# EAGLE design pic_can_router (EAGLE 6.5.0)
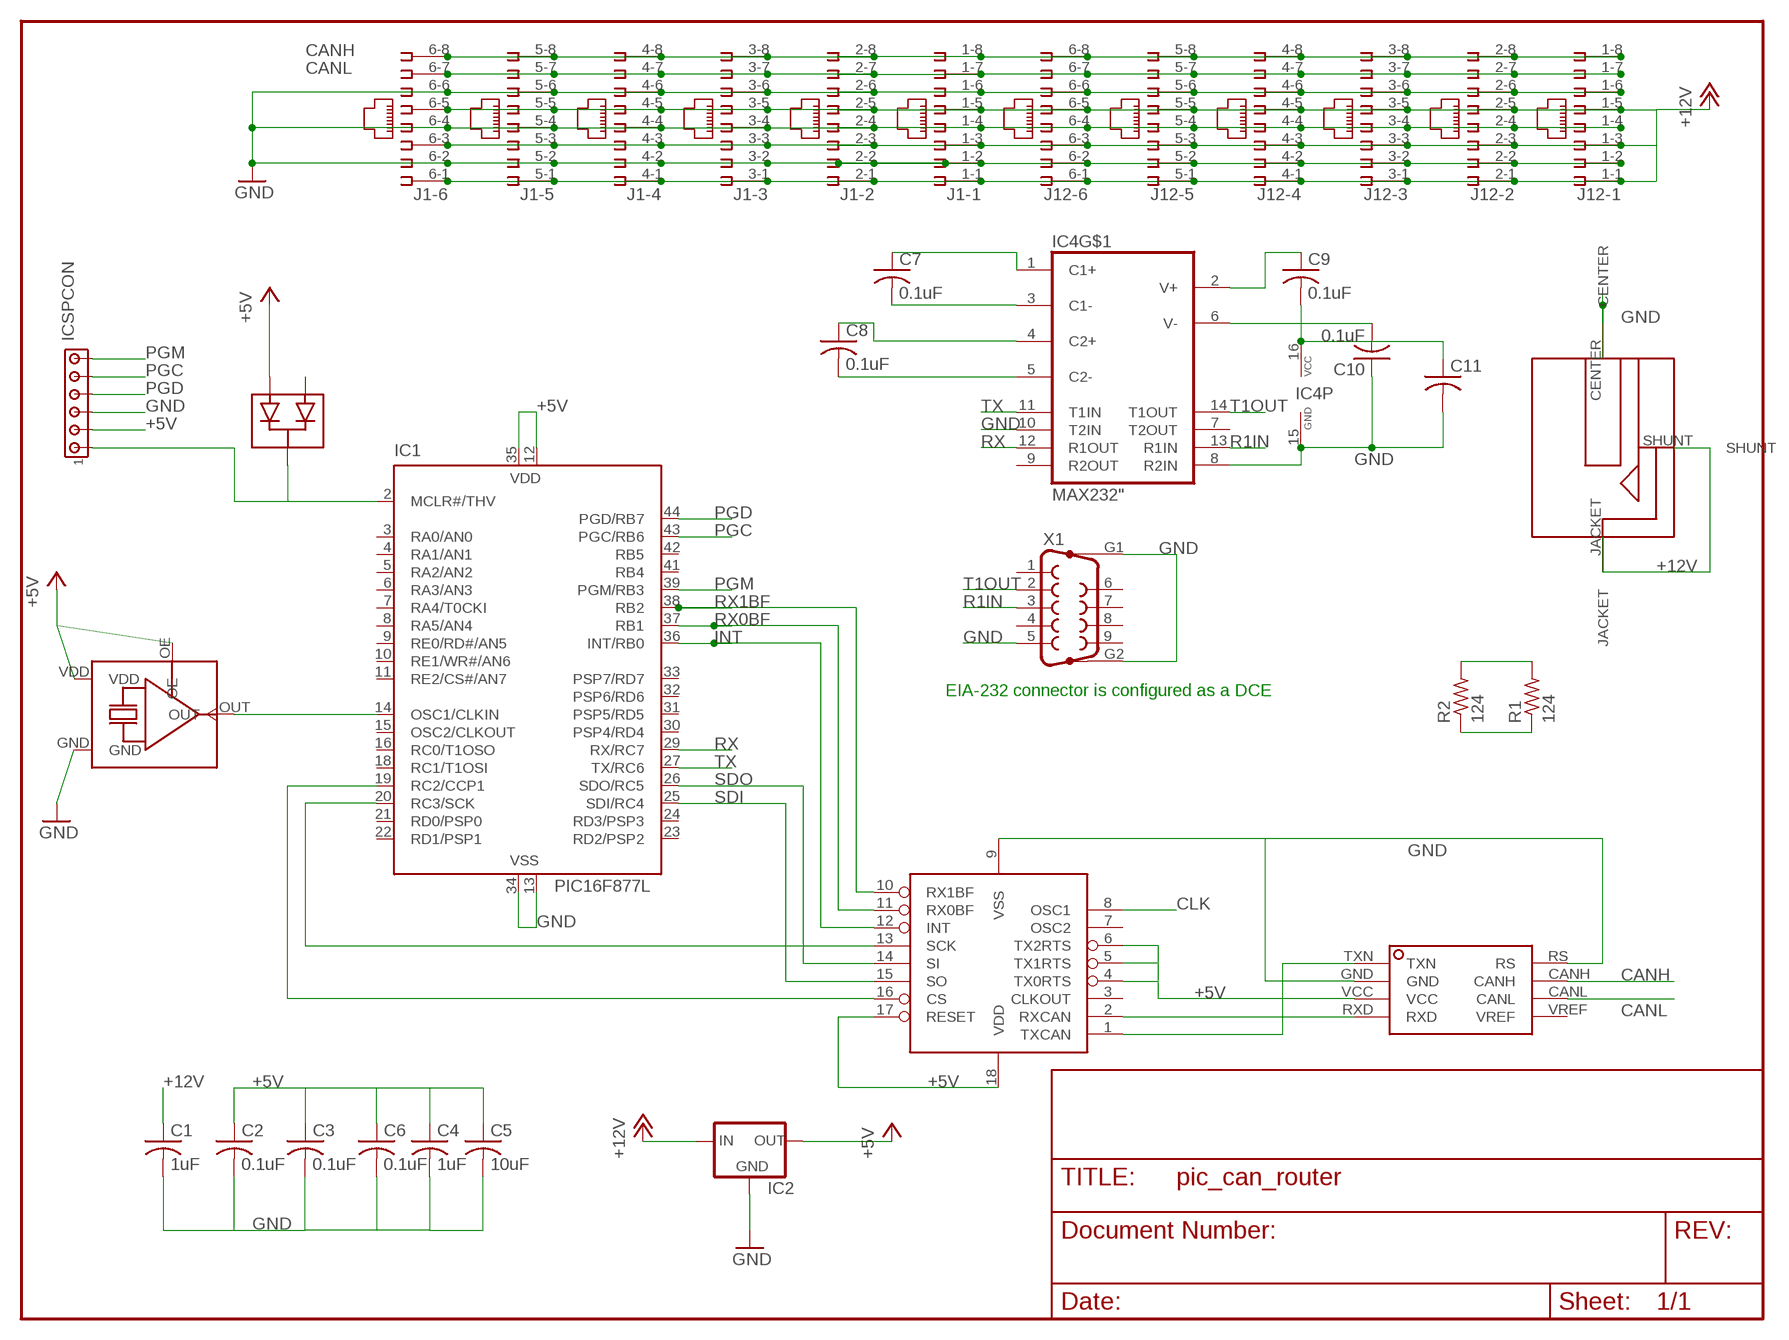
[diagram p0: schematic, sheet 1]

## Parts
C1  1uF  C-USC1206  [C1206]
C2  0.1uF  C-USC0805  [C0805]
C3  0.1uF  C-USC0805  [C0805]
C4  1uF  C-USC1206  [C1206]
C5  10uF  C-USC1210  [C1210]
C6  0.1uF  C-USC0805  [C0805]
C7  0.1uF  C-USC0805  [C0805]
C8  0.1uF  C-USC0805  [C0805]
C9  0.1uF  C-USC0805  [C0805]
C10  0.1uF  C-USC0805  [C0805]
C11  C-USC0805  [C0805]
IC1  PIC16F877L  [PLCC-44]
IC2  78XXL  [78XXL]
IC3  UC5350D  [SOIC8]
IC4  MAX232"  [SO16]
ICSPCON  MTA06-100  [10X06MTA]
J1  557564-1  [557564-1]
J12  557564-1  [557564-1]
MCP1  MCP2510-I/SO  [SO-18W@1]
R1  124  R-US_R0805  [R0805]
R2  124  R-US_R0805  [R0805]
U$1  SG-615P  [SG-615]
U$2  BAV70_  [SOT-23]
U$3  RAPC712"  [RAPC712]
X1  F09HP  [F09HP]

## Nets
+5V: C2.1 C3.1 C4.1 C5.1 C6.1 C9.2 C11.1 IC1.12(VDD) IC1.35(VDD) IC2.OUT IC3.VCC IC4.16(P:VCC) ICSPCON.5 MCP1.4(TX0RTS) MCP1.5(TX1RTS) MCP1.6(TX2RTS) MCP1.17(RESET) MCP1.18(VDD) U$1.OE U$1.VDD U$2.2(A2)
+12V: C1.1 IC2.IN J1.1-1 J1.1-3 J1.1-5 J1.2-1 J1.2-3 J1.2-5 J1.3-1 J1.3-3 J1.3-5 J1.4-1 J1.4-3 J1.4-5 J1.5-1 J1.5-3 J1.5-5 J1.6-1 J1.6-3 J1.6-5 J12.1-1 J12.1-3 J12.1-5 J12.2-1 J12.2-3 J12.2-5 J12.3-1 J12.3-3 J12.3-5 J12.4-1 J12.4-3 J12.4-5 J12.5-1 J12.5-3 J12.5-5 J12.6-1 J12.6-3 J12.6-5 U$3.JACKET U$3.SHUNT
CANH: IC3.CANH J1.1-8 J1.2-8 J1.3-8 J1.4-8 J1.5-8 J1.6-8 J12.1-8 J12.2-8 J12.3-8 J12.4-8 J12.5-8 J12.6-8 R1.2 R2.2
CANL: IC3.CANL J1.1-7 J1.2-7 J1.3-7 J1.4-7 J1.5-7 J1.6-7 J12.1-7 J12.2-7 J12.3-7 J12.4-7 J12.5-7 J12.6-7 R1.1 R2.1
CLK: IC1.14(OSC1/CLKIN) MCP1.8(OSC1) U$1.OUT
CS: IC1.19(RC2/CCP1) MCP1.16(CS)
GND: C1.2 C2.2 C3.2 C4.2 C5.2 C6.2 C10.1 C11.2 IC1.13(VSS) IC1.34(VSS) IC2.GND IC3.GND IC3.RS IC4.8(R2IN) IC4.10(T2IN) IC4.15(P:GND) ICSPCON.4 J1.1-2 J1.1-4 J1.1-6 J1.2-2 J1.2-4 J1.2-6 J1.3-2 J1.3-4 J1.3-6 J1.4-2 J1.4-4 J1.4-6 J1.5-2 J1.5-4 J1.5-6 J1.6-2 J1.6-4 J1.6-6 J12.1-2 J12.1-4 J12.1-6 J12.2-2 J12.2-4 J12.2-6 J12.3-2 J12.3-4 J12.3-6 J12.4-2 J12.4-4 J12.4-6 J12.5-2 J12.5-4 J12.5-6 J12.6-2 J12.6-4 J12.6-6 MCP1.9(VSS) U$1.GND U$3.CENTER X1.5 X1.G1 X1.G2
INT: IC1.36(INT/RB0) MCP1.12(INT)
N$1: C7.1 IC4.1(C1+)
N$2: C7.2 IC4.3(C1-)
N$3: C8.2 IC4.5(C2-)
N$4: C8.1 IC4.4(C2+)
N$6: IC1.2(MCLR#/THV) ICSPCON.6 U$2.3(C)
N$7: C9.1 IC4.2(V+)
N$8: C10.2 IC4.6(V-)
PGC: IC1.43(PGC/RB6) ICSPCON.2
PGD: IC1.44(PGD/RB7) ICSPCON.3
PGM: IC1.39(PGM/RB3) ICSPCON.1
R1IN: IC4.13(R1IN) X1.3
RX: IC1.29(RX/RC7) IC4.12(R1OUT)
RX0BF: IC1.37(RB1) MCP1.11(RX0BF)
RX1BF: IC1.38(RB2) MCP1.10(RX1BF)
RXCAN: IC3.RXD MCP1.2(RXCAN)
SCK: IC1.20(RC3/SCK) MCP1.13(SCK)
SDI: IC1.25(SDI/RC4) MCP1.15(SO)
SDO: IC1.26(SDO/RC5) MCP1.14(SI)
T1OUT: IC4.14(T1OUT) X1.2
TX: IC1.27(TX/RC6) IC4.11(T1IN)
TXCAN: IC3.TXN MCP1.1(TXCAN)
Unconnected: IC1.3(RA0/AN0) IC1.4(RA1/AN1) IC1.5(RA2/AN2) IC1.6(RA3/AN3) IC1.7(RA4/T0CKI) IC1.8(RA5/AN4) IC1.9(RE0/RD#/AN5) IC1.10(RE1/WR#/AN6) IC1.11(RE2/CS#/AN7) IC1.15(OSC2/CLKOUT) IC1.16(RC0/T1OSO) IC1.18(RC1/T1OSI) IC1.21(RD0/PSP0) IC1.22(RD1/PSP1) IC1.23(RD2/PSP2) IC1.24(RD3/PSP3) IC1.30(PSP4/RD4) IC1.31(PSP5/RD5) IC1.32(PSP6/RD6) IC1.33(PSP7/RD7) IC1.41(RB4) IC1.42(RB5) IC3.VREF IC4.7(T2OUT) IC4.9(R2OUT) MCP1.3(CLKOUT) MCP1.7(OSC2) U$2.1(A1) X1.1 X1.4 X1.6 X1.7 X1.8 X1.9

## Notes on the sheet
- EIA-232 connector is configured as a DCE

## Library data of the parts
C1-C11 = rcl:C-US: CAPACITOR, American symbol
IC1 = microchip:PIC16F87*: MICROCONTROLLER
IC2 = v-reg:78XXL: VOLTAGE REGULATOR
IC3 = house:UC5350: CAN Tranceiver
IC4 = maxim:MAX232: RS232 TRANSEIVER
ICSPCON = con-amp:MTA06-100: AMP CONNECTOR
J1 J12 = con-amp:557564-1: AMP CONNECTOR
MCP1 = microchip:MCP2510
R1 R2 = rcl:R-US_: RESISTOR, American symbol
U$1 = house:SG-615: Epson Electronics CMOS/TTL SMD Oscillator
U$2 = house:BAV70: Fairchild Semiconductor Small Signal, Dual, Common Cathode, SOT-23 Diode
U$3 = house:RAPC712
X1 = con-subd:F09HP: SUB-D

## Board
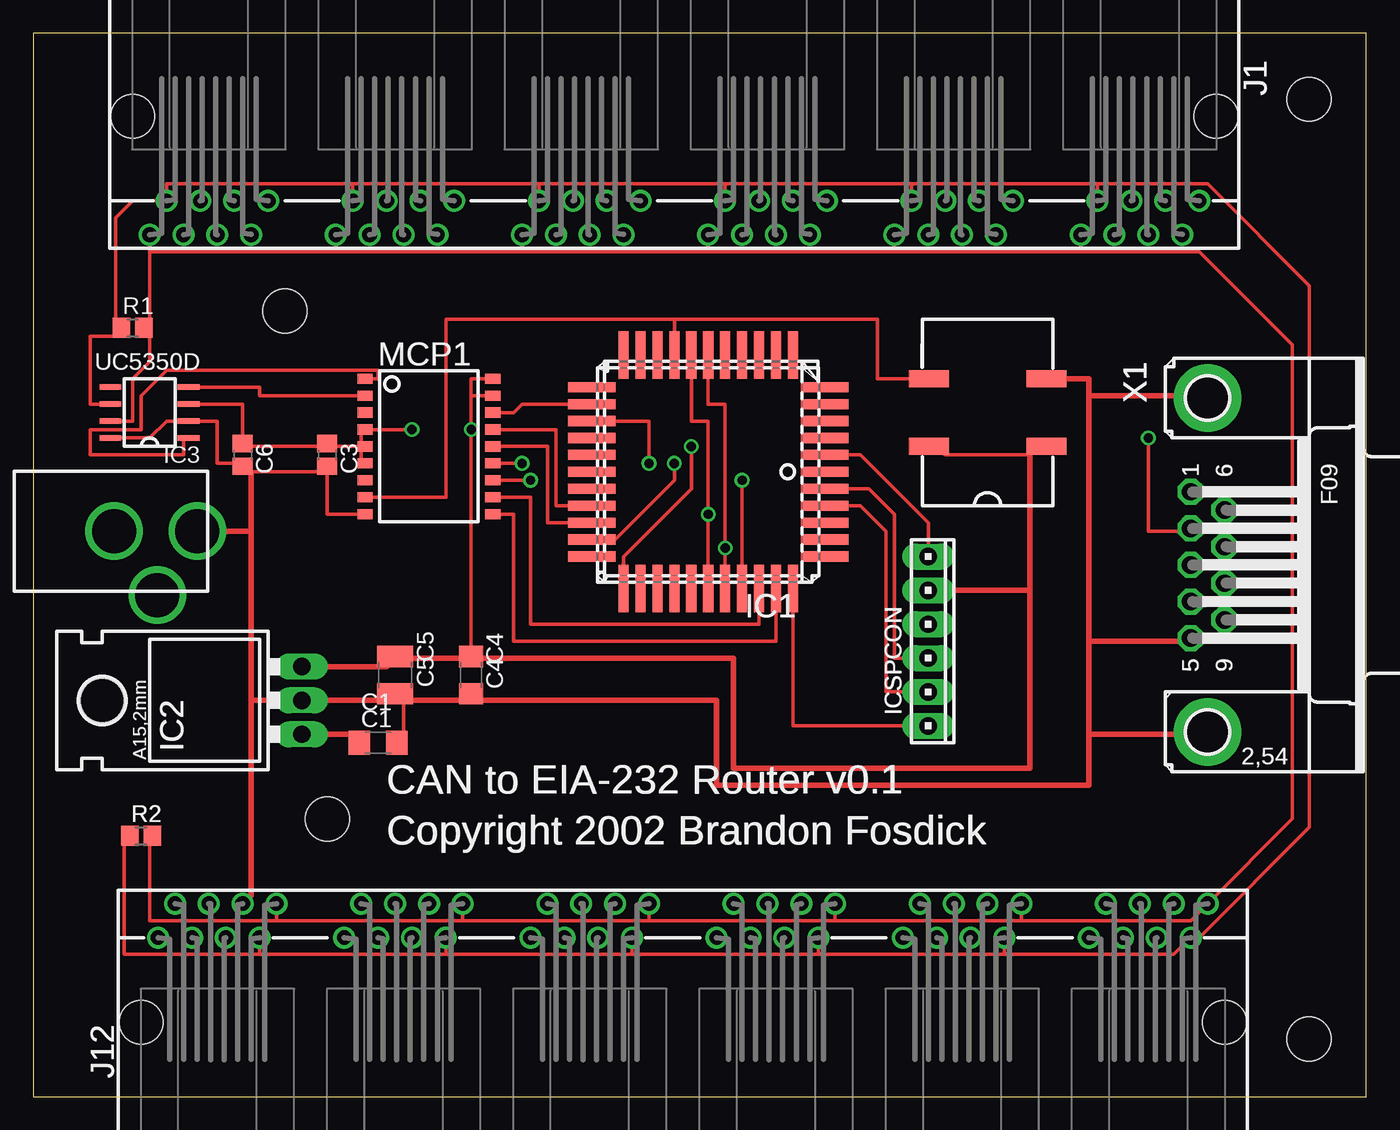
[diagram p1: board, top side]
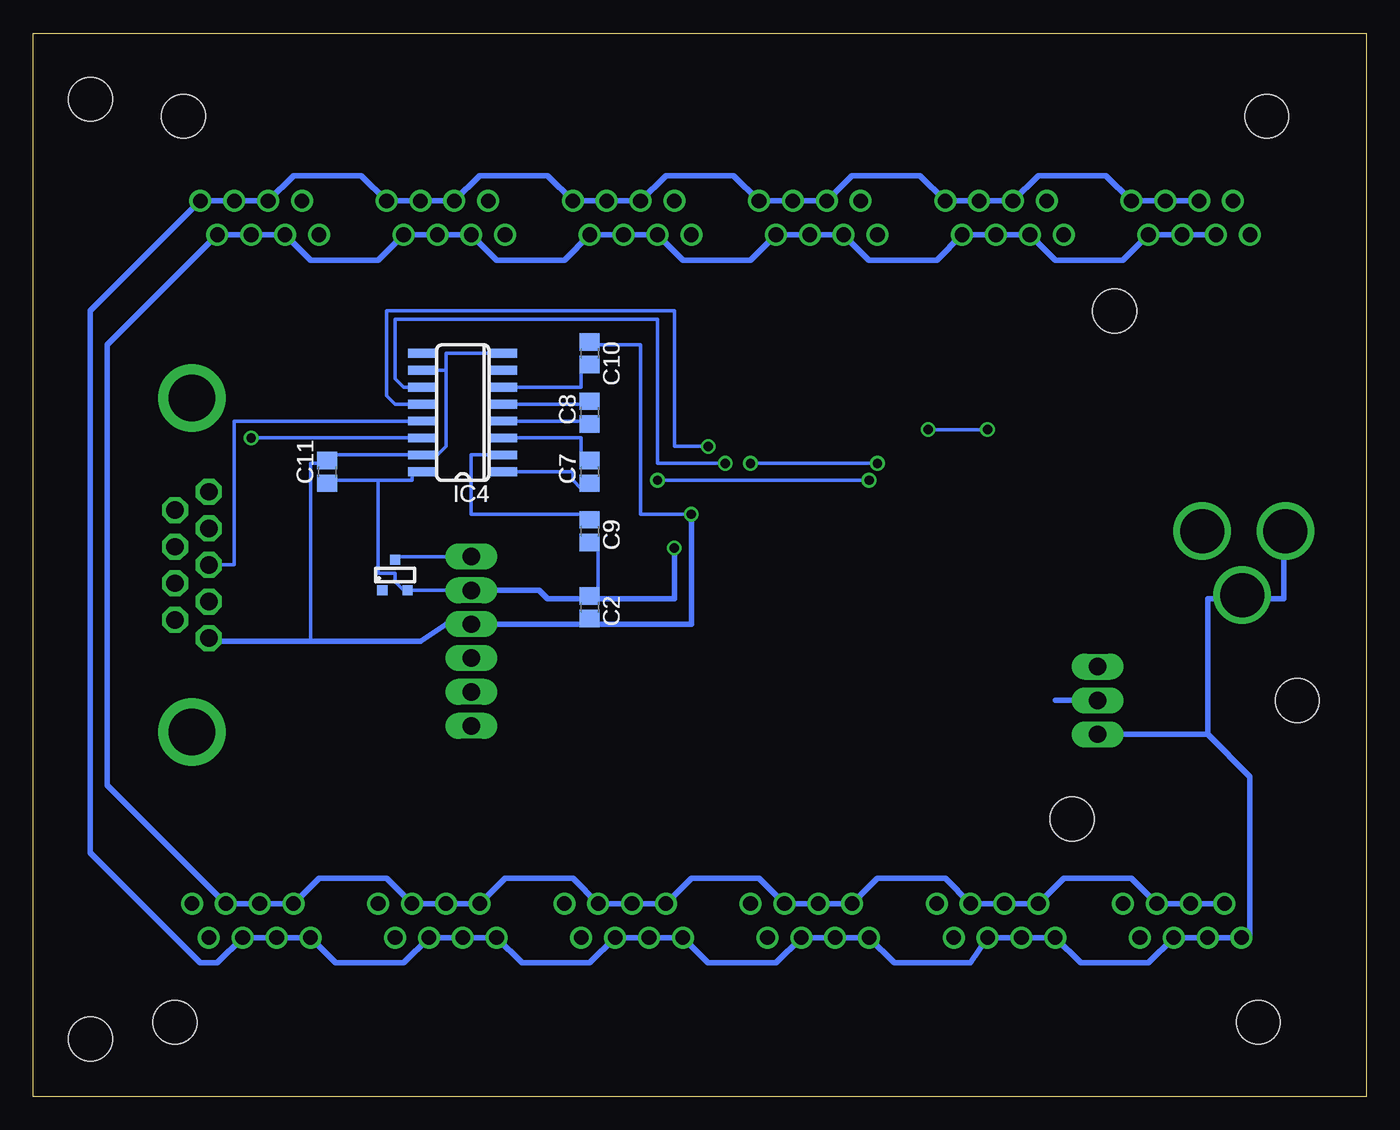
[diagram p2: board, bottom side, seen from below]

Size 100 x 79.75 mm. Coordinates in mm from the lower left corner, seen from the top.
Outline: 0,0 100,0 100,79.75 0,79.75 0,0
Copper layers (1*16): Top 0.035mm / dielectric 1.5mm / Bottom 0.035mm
Design rules "10mils": minimum track width 10mil, minimum drill 24mil, track to track 10mil, track to pad 10mil, pad to pad 10mil, via to via 10mil, smd to smd 10mil, copper to edge 40mil, drill to drill 10mil, minimum pad ring 10mil, minimum via ring 8mil, stop-mask expansion 0mil, vias tented up to drill 0mil, thermal gap 10mil
Holes 3.3 mm at 22.06,20.82 95.72,4.31 95.72,74.8 18.88,58.92

### Footprints (pad centres in the part's own frame; a part is rotated, then mirrored left to right if it is on the bottom)
C1206 = smd 1.6 x 1.8: 1 -1.4,0; 2 1.4,0
C0805 = smd 1.3 x 1.5: 1 -0.85,0; 2 0.85,0
C1210 = smd 1.6 x 2.7: 1 -1.4,0; 2 1.4,0
PLCC-44 = smd 3.556 x 0.762: 1 -8.749,0; 2 -8.749,-1.27; 3 -8.749,-2.54; 4 -8.749,-3.81; 5 -8.749,-5.08; 6 -8.749,-6.35; 18 8.749,-6.35; 19 8.749,-5.08; 20 8.749,-3.81; 21 8.749,-2.54; 22 8.749,-1.27; 23 8.749,0; 24 8.749,1.27; 25 8.749,2.54; 26 8.749,3.81; 27 8.749,5.08; 28 8.749,6.35; 40 -8.749,6.35; 41 -8.749,5.08; 42 -8.749,3.81; 43 -8.749,2.54; 44 -8.749,1.27 | smd 0.762 x 3.556: 7 -6.35,-8.749; 8 -5.08,-8.749; 9 -3.81,-8.749; 10 -2.54,-8.749; 11 -1.27,-8.749; 12 0,-8.749; 13 1.27,-8.749; 14 2.54,-8.749; 15 3.81,-8.749; 16 5.08,-8.749; 17 6.35,-8.749; 29 6.35,8.749; 30 5.08,8.749; 31 3.81,8.749; 32 2.54,8.749; 33 1.27,8.749; 34 0,8.749; 35 -1.27,8.749; 36 -2.54,8.749; 37 -3.81,8.749; 38 -5.08,8.749; 39 -6.35,8.749
78XXL = drill 1.3 long: GND 0,-3.81; IN -2.54,-3.81; OUT 2.54,-3.81 | hole 3.302: 0,11.176
SOIC8 = smd 1.626 x 0.406: CANH 2.934,1.27; CANL 2.934,0; GND -2.934,1.27; RS 2.934,2.54; RXD -2.934,-1.27; TXN -2.934,2.54; VCC -2.934,0; VREF 2.934,-1.27
SO16 = smd 0.66 x 2.032: 1 -4.445,-3.073; 2 -3.175,-3.073; 3 -1.905,-3.073; 4 -0.635,-3.073; 5 0.635,-3.073; 6 1.905,-3.073; 7 3.175,-3.073; 8 4.445,-3.073; 9 4.445,3.073; 10 3.175,3.073; 11 1.905,3.073; 12 0.635,3.073; 13 -0.635,3.073; 14 -1.905,3.073; 15 -3.175,3.073; 16 -4.445,3.073
10X06MTA = drill 1.3 long: 1 6.35,0; 2 3.81,0; 3 1.27,0; 4 -1.27,0; 5 -3.81,0; 6 -6.35,0
557564-1 = drill 1.1: 1-1 -39.37,6.35; 1-2 -38.1,8.89; 1-3 -36.83,6.35; 1-4 -35.56,8.89; 1-5 -34.29,6.35; 1-6 -33.02,8.89; 1-7 -31.75,6.35; 1-8 -30.48,8.89; 2-1 -25.4,6.35; 2-2 -24.13,8.89; 2-3 -22.86,6.35; 2-4 -21.59,8.89; 2-5 -20.32,6.35; 2-6 -19.05,8.89; 2-7 -17.78,6.35; 2-8 -16.51,8.89; 3-1 -11.43,6.35; 3-2 -10.16,8.89; 3-3 -8.89,6.35; 3-4 -7.62,8.89; 3-5 -6.35,6.35; 3-6 -5.08,8.89; 3-7 -3.81,6.35; 3-8 -2.54,8.89; 4-1 2.54,6.35; 4-2 3.81,8.89; 4-3 5.08,6.35; 4-4 6.35,8.89; 4-5 7.62,6.35; 4-6 8.89,8.89; 4-7 10.16,6.35; 4-8 11.43,8.89; 5-1 16.51,6.35; 5-2 17.78,8.89; 5-3 19.05,6.35; 5-4 20.32,8.89; 5-5 21.59,6.35; 5-6 22.86,8.89; 5-7 24.13,6.35; 5-8 25.4,8.89; 6-1 30.48,6.35; 6-2 31.75,8.89; 6-3 33.02,6.35; 6-4 34.29,8.89; 6-5 35.56,6.35; 6-6 36.83,8.89; 6-7 38.1,6.35; 6-8 39.37,8.89 | hole 3.3: -40.64,0; 40.64,0
SO-18W@1 = smd 0.762 x 1.143: 1 -5.08,-4.788; 2 -3.81,-4.788; 3 -2.54,-4.788; 4 -1.27,-4.788; 5 0,-4.788; 6 1.27,-4.788; 7 2.54,-4.788; 8 3.81,-4.788; 9 5.08,-4.788; 10 5.08,4.788; 11 3.81,4.788; 12 2.54,4.788; 13 1.27,4.788; 14 0,4.788; 15 -1.27,4.788; 16 -2.54,4.788; 17 -3.81,4.788; 18 -5.08,4.788
R0805 = smd 1.3 x 1.5: 1 -0.85,0; 2 0.85,0
SG-615 = smd 1.27 x 3: GND 2.54,-4.4; OE -2.54,-4.4; OUT 2.54,4.41; VDD -2.54,4.4
SOT-23 = smd 0.76 x 0.76: 1 -0.95,0; 2 0.95,0; 3 0,2.29
RAPC712 = drill 3.3: CENTER 0,13.74; JACKET 0,7.49; SHUNT 4.8,10.74
F09HP = drill 1.3 octagon: 1 -5.486,-1.27; 2 -2.743,-1.27; 3 0,-1.27; 4 2.743,-1.27; 5 5.486,-1.27; 6 -4.115,1.27; 7 -1.372,1.27; 8 1.372,1.27; 9 4.115,1.27 | drill 3.5 pad 5.08: G1 -12.522,0; G2 12.522,0

### Placement (x,y rotation side)
C1  25.87,26.54 0 top
C2  58.25,36.7 270 bottom
C3  22.06,48.13 270 top
C4  32.85,31.62 270 top
C5  27.14,31.62 270 top
C6  15.71,48.13 270 top
C7  58.25,46.86 90 bottom
C8  58.25,51.3 90 bottom
C9  58.25,42.41 270 bottom
C10  58.25,55.75 270 bottom
C11  77.94,46.86 90 bottom
IC1  50.63,46.86 180 top
IC2  16.34,29.71 90 top
IC3  8.73,51.94 180 top
IC4  67.78,51.3 90 bottom
ICSPCON  67.14,34.16 270 top
J1  48.09,73.53 180 top
J12  48.73,5.58 0 top
MCP1  29.68,48.76 270 top
R1  7.46,57.65 0 top
R2  8.09,19.55 0 top
U$1  71.59,51.3 90 top
U$2  72.86,37.97 0 bottom
U$3  -1.44,42.41 270 top
X1  88.1,39.87 270 top

### Tracks (layer width: path | path; a pad name or v marks a point on that pad's centre or on a via)
+5V  (via drill 0.7)
  Top 0.254: 32.85,52.57 32.85,53.84 MCP1.18 33.49,53.84 | 32.85,52.57 v32.85,50.03 C4.1 | 32.85,52.57 MCP1.17 | v28.41,50.03 MCP1.4 24.6,50.03 24.6,48.76 | IC3.VCC 15.71,51.94 15.71,48.76 15.08,48.76 C6.1 16.34,48.76 21.42,48.76 C3.1 22.7,48.76 24.6,48.76 | 24.6,48.76 24.6,47.49 MCP1.6 | 24.6,48.76 MCP1.5 | U$1.VDD 68.41,48.13 74.77,48.13 U$1.OE | 28.41,32.89 C5.1 26.5,32.25 | 32.22,32.89 C4.1 | 50.63,53.84 50.63,51.94 51.91,51.94 v51.91,41.14 IC1.35 | 50.63,53.84 50.63,54.48 | C4.1 32.85,32.89 | 50.63,53.84 IC1.12
  Top 0.406: 28.41,32.89 32.22,32.89 | IC2.OUT 26.5,32.25 | 74.77,37.97 74.77,48.13 | 74.77,37.97 ICSPCON.5 | 32.85,32.89 52.54,32.89 52.54,24.63 74.77,24.63 74.77,37.97
  Bottom 0.254: v32.85,50.03 v28.41,50.03 | ICSPCON.5 U$2.2 72.22,37.97 72.86,38.6 72.86,39.24 74.13,39.24 74.13,46.22 | 70.32,46.86 IC4.16 71.59,46.86 71.59,46.22 74.13,46.22 | 74.13,46.22 77.3,46.22 C11.1 | 57.62,37.33 C2.1 57.62,37.97 57.62,41.14 C9.2
  Bottom 0.406: v51.91,41.14 51.91,37.33 57.62,37.33 61.43,37.33 62.06,37.97 ICSPCON.5
+12V
  Top 0.254: 24.6,27.17 C1.1
  Top 0.406: IC2.IN 24.6,27.17
  Bottom 0.254: 9.36,37.33 U$3.SHUNT | 6.18,41.14 U$3.JACKET
  Bottom 0.406: J1.6-5 J1.6-3 J1.6-1 19.52,69.08 24.6,69.08 J1.5-5 J1.5-3 J1.5-1 33.49,69.08 38.57,69.08 J1.4-5 J1.4-3 J1.4-1 47.46,69.08 52.54,69.08 J1.3-5 J1.3-3 J1.3-1 61.43,69.08 66.51,69.08 J1.2-5 J1.2-3 J1.2-1 75.4,69.08 80.48,69.08 J1.1-5 J1.1-3 J1.1-1 95.72,58.92 95.72,18.28 87.47,10.03 86.19,10.03 J12.6-5 J12.6-3 J12.6-1 77.3,10.03 72.22,10.03 J12.5-5 J12.5-3 J12.5-1 63.34,10.03 58.25,10.03 J12.4-5 J12.4-3 J12.4-1 49.37,10.03 44.28,10.03 J12.3-5 J12.3-3 J12.3-1 35.39,10.03 29.68,10.03 J12.2-5 J12.2-3 J12.2-1 21.42,10.03 16.34,10.03 J12.1-5 J12.1-3 J12.1-1 8.73,11.93 8.73,24 11.9,27.17 | 11.9,27.17 11.9,37.33 9.36,37.33 6.18,37.33 6.18,41.14 6.18,42.41 | 11.9,27.17 IC2.IN
CANH
  Top 0.254: 18.25,13.2 J12.1-8 | 18.25,13.2 32.22,13.2 | 32.22,13.2 46.19,13.2 | 32.22,13.2 J12.2-8 | 46.19,13.2 60.16,13.2 | 46.19,13.2 J12.3-8 | 74.13,13.2 J12.5-8 | 60.16,13.2 74.13,13.2 | 60.16,13.2 J12.4-8 | 74.13,13.2 86.83,13.2 J12.6-8 94.45,20.82 94.45,56.38 87.47,63.37 78.58,63.37 | 78.58,63.37 64.61,63.37 | 78.58,63.37 J1.1-8 | 8.73,63.37 8.73,57.65 | 8.73,57.65 8.73,57.02 | 8.73,57.02 8.73,55.11 7.46,53.84 7.46,50.67 IC3.CANH | 8.73,63.37 J1.6-8 | 64.61,63.37 J1.2-8 | 64.61,63.37 50.63,63.37 | 50.63,63.37 36.66,63.37 | 36.66,63.37 22.7,63.37 | 22.7,63.37 8.73,63.37 | 18.25,13.2 8.73,13.2 8.73,18.92 | 8.73,18.92 8.73,19.55 | 50.63,63.37 J1.3-8 | 36.66,63.37 J1.4-8 | 22.7,63.37 J1.5-8 | 8.73,57.65 R1.2 | R1.2 8.09,57.65 | 8.73,18.92 R2.2 | 8.73,57.02 R1.2
CANL
  Top 0.254: IC3.CANL 4.28,51.94 4.28,57.02 6.18,57.02 R1.1 6.18,58.29 6.18,65.91 7.46,67.18 J1.6-7 10,68.45 23.96,68.45 | 65.88,68.45 J1.2-7 | 79.84,68.45 65.88,68.45 | 65.88,68.45 51.91,68.45 | 51.91,68.45 37.94,68.45 | 37.94,68.45 23.96,68.45 | 16.98,10.66 J12.1-7 | 16.98,10.66 30.95,10.66 | 30.95,10.66 J12.2-7 | 44.92,10.66 J12.3-7 | 30.95,10.66 44.92,10.66 | 58.89,10.66 J12.4-7 | 44.92,10.66 58.89,10.66 | 72.86,10.66 J12.5-7 | 58.89,10.66 72.86,10.66 | 72.86,10.66 85.56,10.66 J12.6-7 87.47,11.93 95.72,20.19 95.72,60.83 88.1,68.45 79.84,68.45 | 79.84,68.45 J1.1-7 | 16.98,10.66 6.82,10.66 6.82,18.92 | 6.82,18.92 6.82,19.55 | 51.91,68.45 J1.3-7 | 37.94,68.45 J1.4-7 | 23.96,68.45 J1.5-7 | 6.82,18.92 R2.1
CLK
  Top 0.254: MCP1.8 30.95,44.95 30.95,58.29 48.09,58.29 | 48.09,58.29 63.34,58.29 63.34,53.84 65.88,53.84 | 65.88,53.84 67.14,53.84 | 48.09,58.29 IC1.14 | 65.88,53.84 U$1.OUT
CS
  Top 0.254: MCP1.16 36.03,51.3 36.66,51.94 IC1.19
GND  (via drill 0.7)
  Top 0.254: IC3.RS 8.73,49.4 10,50.67 IC3.GND 13.81,50.67 13.81,47.49 15.08,47.49 C6.2 16.34,46.86 21.42,46.86 C3.2 22.06,43.68 MCP1.9 | 32.22,29.71 C4.2 33.49,29.71 | C5.2 28.41,29.71 | 25.87,29.71 C5.2 | IC1.13 49.37,50.67 50.63,50.67 v50.63,43.68 IC1.34 | C1.2 27.77,26.54 27.77,29.71 C5.2 | 86.19,34.16 X1.5 | 76.67,53.84 U$1.GND | 12.54,42.41 U$3.CENTER | 86.19,27.17 X1.G2 | 86.19,52.57 X1.G1
  Top 0.406: 28.41,29.71 32.22,29.71 | 16.34,29.71 16.34,42.41 | 16.34,42.41 16.34,46.86 | 16.34,29.71 IC2.GND 25.87,29.71 | 33.49,29.71 51.27,29.71 51.27,23.36 79.21,23.36 79.21,27.17 | 76.67,53.84 79.21,53.84 79.21,52.57 | 79.21,34.16 79.21,52.57 | 79.21,27.17 79.21,34.16 | 79.21,34.16 86.19,34.16 86.83,34.16 | 79.21,52.57 86.19,52.57 88.1,52.57 | 79.21,27.17 86.19,27.17 88.1,27.17 | 16.34,42.41 12.54,42.41 | 16.34,29.71 16.34,15.11 J12.1-6
  Bottom 0.254: X1.5 86.19,34.16 | v50.63,43.68 54.45,43.68 54.45,56.38 57.62,56.38 C10.1 | 79.21,34.16 79.21,47.49 78.58,47.49 C11.2 77.3,48.13 IC4.15 69.69,48.13 69.05,48.76 69.05,54.48 | 69.05,54.48 IC4.10 | 69.05,54.48 69.05,55.75 IC4.8 | 53.81,64.64 J1.3-6 | 57.62,35.43 C2.2
  Bottom 0.406: 86.19,34.16 79.21,34.16 70.95,34.16 69.05,35.43 ICSPCON.4 57.62,35.43 50.63,35.43 v50.63,43.68 | J12.1-2 J12.1-4 J12.1-6 17.61,16.38 22.7,16.38 J12.2-2 J12.2-4 J12.2-6 31.58,16.38 36.66,16.38 J12.3-2 J12.3-4 J12.3-6 45.55,16.38 50.63,16.38 J12.4-2 J12.4-4 J12.4-6 59.52,16.38 64.61,16.38 J12.5-2 J12.5-4 J12.5-6 73.5,16.38 78.58,16.38 J12.6-2 J12.6-4 J12.6-6 94.45,23.36 94.45,56.38 J1.1-2 J1.1-4 J1.1-6 79.21,62.73 74.13,62.73 J1.2-2 J1.2-4 J1.2-6 65.24,62.73 60.16,62.73 J1.3-2 J1.3-4 53.81,64.64 | J1.3-6 51.27,62.73 46.19,62.73 J1.4-2 J1.4-4 J1.4-6 37.3,62.73 32.22,62.73 J1.5-2 J1.5-4 J1.5-6 23.33,62.73 18.25,62.73 J1.6-2 J1.6-4 J1.6-6 | IC2.GND 23.33,29.71
INT  (via drill 0.7)
  Top 0.254: MCP1.12 v37.3,46.22 | v53.17,46.22 IC1.36
  Bottom 0.254: v37.3,46.22 v53.17,46.22
N$1
  Bottom 0.254: IC4.1 59.52,46.86 59.52,46.22 58.89,45.59 C7.1
N$2
  Bottom 0.254: IC4.3 58.89,49.4 58.89,48.13 C7.2
N$3
  Bottom 0.254: IC4.5 58.89,51.94 C8.2
N$4
  Bottom 0.254: IC4.4 58.89,50.67 C8.1
N$6
  Top 0.254: IC1.2 62.06,48.13 67.14,43.05 ICSPCON.6
  Bottom 0.254: U$2.3 72.86,40.51 ICSPCON.6
N$7
  Bottom 0.254: IC4.2 67.14,48.13 67.14,43.68 58.89,43.68 C9.1
N$8
  Bottom 0.254: IC4.6 58.89,53.21 58.89,54.48 C10.2
PGC
  Top 0.254: ICSPCON.2 63.97,30.35 63.97,42.41 62.06,44.32 IC1.43
PGD
  Top 0.254: IC1.44 62.7,45.59 64.61,43.68 64.61,32.89 ICSPCON.3
PGM
  Top 0.254: IC1.39 56.98,27.81 ICSPCON.1
R1IN
  Bottom 0.254: X1.3 84.92,39.87 84.92,50.67 IC4.13
RX  (via drill 0.7)
  Top 0.254: v49.37,48.76 49.37,45.59 44.28,40.51 IC1.29
  Bottom 0.254: v49.37,48.76 51.91,48.76 51.91,58.92 73.5,58.92 73.5,52.57 72.86,51.94 IC4.12
RX0BF
  Top 0.254: MCP1.11 37.3,44.95 37.3,35.43 54.45,35.43 IC1.37
RX1BF
  Top 0.254: MCP1.10 36.03,43.68 36.03,34.16 55.71,34.16 IC1.38
RXCAN
  Top 0.254: IC3.RXD 16.98,53.21 16.98,52.57 MCP1.2
SCK  (via drill 0.7)
  Top 0.254: MCP1.13 v36.66,47.49 | v46.19,47.49 46.19,50.67 IC1.20
  Bottom 0.254: v36.66,47.49 v46.19,47.49
SDI
  Top 0.254: IC1.25 39.2,44.32 39.2,50.03 MCP1.15
SDO
  Top 0.254: 35.39,48.76 MCP1.14 38.57,48.76 38.57,43.05 IC1.26
T1OUT  (via drill 0.7)
  Top 0.254: v83.66,49.4 83.66,42.41 86.19,42.41 | 86.19,42.41 86.83,42.41 | 86.19,42.41 X1.2
  Bottom 0.254: IC4.14 v83.66,49.4
TX  (via drill 0.7)
  Top 0.254: v48.09,47.49 48.09,46.22 43.65,41.78 IC1.27
  Bottom 0.254: v48.09,47.49 53.17,47.49 53.17,58.29 72.86,58.29 72.86,53.84 72.22,53.21 IC4.11
TXCAN
  Top 0.254: MCP1.1 25.87,53.84 25.87,54.48 10,54.48 8.09,52.57 8.09,50.03 4.28,50.03 4.28,48.13 11.27,48.13 11.27,49.4 IC3.TXN

### Text on the board
Top: 1 Top
Bottom: 16 Bottom
Pads: 17 Pads
Vias: 18 Vias
Dimension: 20 Dimension
tPlace: 21 tPlace | 21 tPlace | 21 tPlace | 21 tPlace | UC5350D | IC3 | 1 | 1 | 1 | 6 | 6 | 6 | F09 | 5 | 5 | 5 | 9 | 9 | 9 | A15,2mm | 2,54
tNames: 25 tNames | 25 tNames | 25 tNames | 25 tNames | J1 | J1 | J1 | R1 | X1 | X1 | X1 | MCP1 | C6 | C6 | C3 | C3 | IC1 | IC1 | IC1 | ICSPCON | ICSPCON | ICSPCON | C5 | C5 | C4 | C4 | C5 | C4 | C1 | C1 | C1 | IC2 | IC2 | IC2 | CAN to EIA-232 Router v0.1 | CAN to EIA-232 Router v0.1 | CAN to EIA-232 Router v0.1 | CAN to EIA-232 Router v0.1 | R2 | R2 | R2 | Copyright 2002 Brandon Fosdick | Copyright 2002 Brandon Fosdick | Copyright 2002 Brandon Fosdick | Copyright 2002 Brandon Fosdick | J12 | J12 | J12
bNames: C10 | C10 | C10 | C8 | C8 | C8 | C7 | C7 | C7 | IC4 | IC4 | IC4 | C11 | C11 | C11 | C9 | C9 | C9 | C2 | C2 | C2
tValues: PIC16F877L | PIC16F877L | PIC16F877L | 124 | 0.1uF | 0.1uF | 0.1uF | 0.1uF | 0.1uF | 0.1uF | 10uF | 10uF | 1uF | 1uF | 10uF | 1uF | 1uF | 1uF | 1uF | 124 | 124 | 124
bValues: 0.1uF | 0.1uF | 0.1uF | 0.1uF | 0.1uF | 0.1uF | MAX232" | MAX232" | MAX232" | 0.1uF | 0.1uF | 0.1uF | 0.1uF | 0.1uF | 0.1uF | 0.1uF | 0.1uF | 0.1uF
tStop: 29 tStop
bStop: 30 bStop